# Altium project Banker_EDGE_2_DSUB.PrjPCB
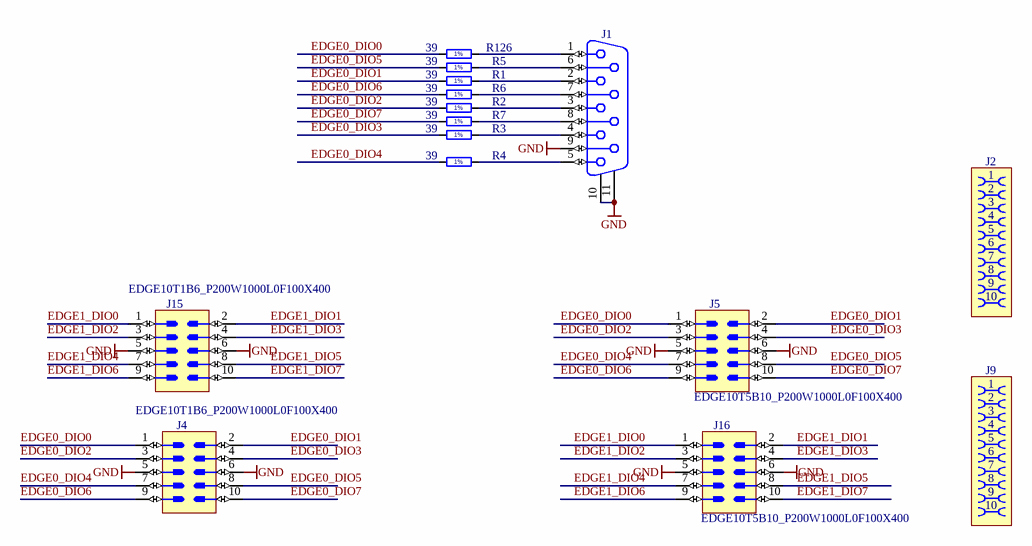
[diagram p0: Banker_EDGE_2_DSUB.SchDoc]
1 sheet, 15 parts. Net scope: global (net labels, ports and power ports of the same name join across sheets).
Board file: Banker_EDGE_2_DSUB.PCBDOC

## Sheet Banker_EDGE_2_DSUB.SchDoc: Banker EDGE to D-Sub 9
size 420 x 297 mm; Author: G.Kasprowicz; CompanyName: WUT ISE; DrawnBy: G.Kasprowicz; Organization: WUT ISE; Address1: PW ISE; Address2: Nowowiejska 15/19 00-665 Warsaw; Address3: gkasprow@gmail.com; Revision: 1.0; SheetNumber: -; SheetTotal: -; ModifiedBy: -; CheckedDate: -; Title2: adapter; DivGrp: WUT ISE; Designer: G.Kasprowicz; ModifiedDate: -; ProjectName: Sensor Box

### Parts
J1  D-Sub  [AMPHENOL_L77SDEH09SOL2RM5]  (value not drawn)
J2  (no value)  [AVX_00 9159 010 061 916]
J4  (no value)  [EDGE10T1B6_P200W1000L0F100X400]
J5  (no value)  [EDGE10T5B10_P200W1000L0F100X400]
J9  (no value)  [AVX_00 9159 010 061 916]
J15  (no value)  [EDGE10T1B6_P200W1000L0F100X400]
J16  (no value)  [EDGE10T5B10_P200W1000L0F100X400]
R1  39  [RESC2012X60N]
R2  39  [RESC2012X60N]
R3  39  [RESC2012X60N]
R4  39  [RESC2012X60N]
R5  39  [RESC2012X60N]
R6  39  [RESC2012X60N]
R7  39  [RESC2012X60N]
R126  39  [RESC2012X60N]

### Nets
GND: J1.9 J1.10 J1.11 J4.5 J4.6 J5.5 J5.6 J15.5 J15.6 J16.5 J16.6
EDGE0_DIO0: J4.1 J5.1 R126.1
EDGE0_DIO1: J4.2 J5.2 R1.1
EDGE0_DIO2: J4.3 J5.3 R2.1
EDGE0_DIO3: J4.4 J5.4 R3.1
EDGE0_DIO4: J4.7 J5.7 R4.1
EDGE0_DIO5: J4.8 J5.8 R5.1
EDGE0_DIO6: J4.9 J5.9 R6.1
EDGE0_DIO7: J4.10 J5.10 R7.1
EDGE1_DIO0: J15.1 J16.1
EDGE1_DIO1: J15.2 J16.2
EDGE1_DIO2: J15.3 J16.3
EDGE1_DIO3: J15.4 J16.4
EDGE1_DIO4: J15.7 J16.7
EDGE1_DIO5: J15.8 J16.8
EDGE1_DIO6: J15.9 J16.9
EDGE1_DIO7: J15.10 J16.10
NetJ1_1: J1.1 R126.2
NetJ1_2: J1.2 R1.2
NetJ1_3: J1.3 R2.2
NetJ1_4: J1.4 R3.2
NetJ1_5: J1.5 R4.2
NetJ1_6: J1.6 R5.2
NetJ1_7: J1.7 R6.2
NetJ1_8: J1.8 R7.2

### Notes on the sheet
- Project/Equipment
- Document
- Designer
- Drawn by
- Check.by
- Copyright WUT ISE 2018.
  This documentation describes Open Hardware and is licensed under the CERN OHL v.1.1. You may redistribute and modify this documentation under the terms of the CERN OHL v.1.1. (http://ohwr.org/CERNOHL). This documentation is distributed WITHOUT ANY EXPRESS OR IMPLIED WARRANTY, INCLUDING OF MERCHANTABILITY, SATISFACTORY QUALITY AND FITNESS FOR A PARTICULAR PURPOSE. Please see the CERN OHL v.1.1 for applicable conditions.
- Contact
- File
- Last Mod.
- Print Date
- Sheet
- Size
- A3
- of
- Rev
- (in symbol R0805_39R_1%_0.125W_100PPM) 1%

### Library data of the parts
J1 = AMPHENOL_L77SDEH09SOL2RM5: Connector D-sub 9 Female; Part Description: Straight D-Sub 9 Female Contacts with Rear Insert 4-40 and RM5 Standoff Boardlock; PressFit: No; Part Number: AMPHENOL_L77SDEH09SOL2RM5; Component Kind: Standard; Component Type: Standard; Pin Count: 11; Family: D-Sub; Mounted: Yes; Socket: No; SMD: No; Sense: No; Status: None; Manufacturer: AMPHENOL; Manufacturer Part Number: L77SDEH09SOL2RM5; ComponentHeight: 13mm; HelpURL: \\cern.ch\dfs\Applications\Altium\Datasheets\AMPHENOL_L77SDEH09SOL2RM5.pdf; Author: CERN DEM JLC; CreateDate: 04/06/2012; LatestRevisionDate: 04/06/2012
J2 J9 = AVX_00 9159 010 061 916: Open Ended Card Edge Connector, 9159 Series; Part Description: 10 Contacts, 2mm Pitch, Open Ended Card Edge Connector, 9159 Series; Manufacturer: AVX; PressFit: No; Part Number: AVX_00 9159 010 061 916; Component Kind: Standard; Component Type: Standard; Pin Count: 10; Mounted: Yes; Socket: No; SMD: No; Sense: No; Status: None; Manufacturer Part Number: 00 9159 010 061 916; ComponentHeight: 1.6mm; HelpURL: \\cern.ch\dfs\Applications\Altium\Datasheets\AVX_00 9159 010 061 916.pdf; Author: CERN DEM MR; CreateDate: 13.02.2018; LatestRevisionDate: 13.02.2018
J4 J15 = EDGE10T1B6_P200W1000L0F100X400: PCB Edge Connector 10 (2x5); Part Description: 10 Contacts Board Edge Connector, Pitch 2mm, Length 0mm, Width 10mm, Finger Lenght 4mm, Finger Width 1mm; Mounted: No; PressFit: No; Part Number: EDGE10T1B6_P200W1000L0F100X400; Component Kind: Standard (No BOM); Component Type: Standard (No BOM); Pin Count: 10; Socket: No; SMD: No; Sense: No; Status: None; ComponentHeight: 0mm; HelpURL: \\cern.ch\dfs\Applications\Altium\Datasheets\EDGE10T1B6_P200W1000L0F100X400.pdf; Author: CERN DEM MR; CreateDate: 14.02.2018; LatestRevisionDate: 14.02.2018
J5 J16 = EDGE10T5B10_P200W1000L0F100X400: PCB Edge Connector 10 (2x5); Part Description: 10 Contacts Board Edge Connector, Pitch 2mm, Length 0mm, Width 10mm, Finger Lenght 4mm, Finger Width 1mm; Mounted: No; PressFit: No; Part Number: EDGE10T5B10_P200W1000L0F100X400; Component Kind: Standard (No BOM); Component Type: Standard (No BOM); Pin Count: 10; Socket: No; SMD: No; Sense: No; Status: None; ComponentHeight: 0mm; HelpURL: \\cern.ch\dfs\Applications\Altium\Datasheets\EDGE10T5B10_P200W1000L0F100X400.pdf; Author: CERN DEM MR; CreateDate: 14.02.2018; LatestRevisionDate: 14.02.2018
R1-R7 R126 = R0805_39R_1%_0.125W_100PPM: Resistor - 1%; Part Description: General Purpose Thick Film Chip Resistor; Manufacturer: GENERIC; Manufacturer1 Part Number: NRC10F39R0TRF; Power: 0.125W; TC: ±100ppm/°C; PressFit: No; Part Number: R0805_39R_1%_0.125W_100PPM; Component Kind: Standard; Component Type: Standard; Pin Count: 2; Value: 39; Status: Preferred; Tolerance: ±1%; Manufacturer Part Number: R0805_39R_1%_0.125W_100PPM; Case: 0805; Mounted: Yes; Sense: No; Socket: No; SMD: Yes; Manufacturer1 Example: NIC COMPONENT; Manufacturer1 ComponentHeight: 0.6mm; HelpURL: \\cern.ch\dfs\Applications\Altium\Datasheets\R0805_NIC_NRC.pdf; Author: CERN DEM JLC; CreateDate: 03/12/2007; LatestRevisionDate: 13/03/2008